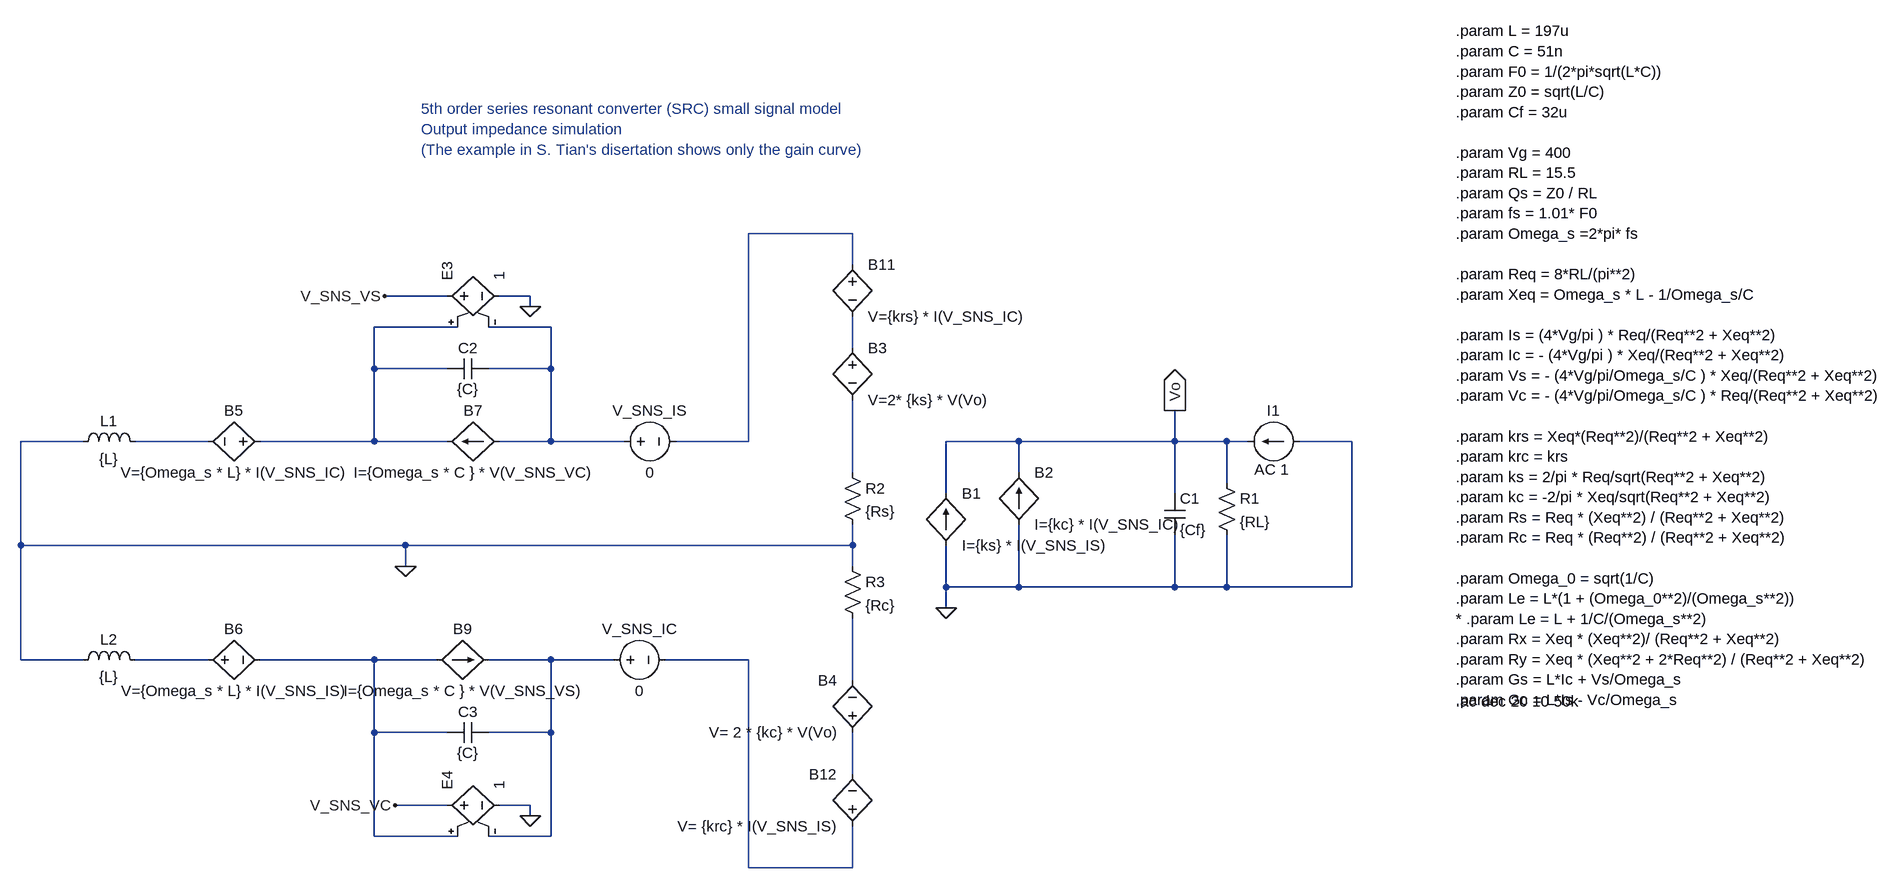
[diagram p0: schematic src_5th_eq_Zout.asc]
src_5th_eq_Zout.asc, the LTspice schematic file:
Version 4
SHEET 1 2688 680
WIRE 544 -496 384 -496
WIRE 544 -448 544 -496
WIRE -80 -400 -176 -400
WIRE 48 -400 0 -400
WIRE 48 -384 48 -400
WIRE -64 -352 -192 -352
WIRE 80 -352 -16 -352
WIRE 544 -320 544 -368
WIRE -192 -288 -192 -352
WIRE -80 -288 -192 -288
WIRE 80 -288 80 -352
WIRE 80 -288 -16 -288
WIRE -640 -176 -736 -176
WIRE -448 -176 -560 -176
WIRE -192 -176 -192 -288
WIRE -192 -176 -368 -176
WIRE -80 -176 -192 -176
WIRE 80 -176 80 -288
WIRE 80 -176 0 -176
WIRE 192 -176 80 -176
WIRE 384 -176 384 -496
WIRE 384 -176 272 -176
WIRE 800 -176 688 -176
WIRE 1040 -176 1040 -224
WIRE 1040 -176 800 -176
WIRE 1120 -176 1040 -176
WIRE 1152 -176 1120 -176
WIRE 1312 -176 1232 -176
WIRE 544 -128 544 -240
WIRE 800 -128 800 -176
WIRE 1120 -112 1120 -176
WIRE 688 -96 688 -176
WIRE 1040 -96 1040 -176
WIRE -736 -16 -736 -176
WIRE -144 -16 -736 -16
WIRE 544 -16 544 -48
WIRE 544 -16 -144 -16
WIRE -144 16 -144 -16
WIRE 544 16 544 -16
WIRE 688 48 688 -16
WIRE 800 48 800 -48
WIRE 800 48 688 48
WIRE 1040 48 1040 -32
WIRE 1040 48 800 48
WIRE 1120 48 1120 -32
WIRE 1120 48 1040 48
WIRE 1312 48 1312 -176
WIRE 1312 48 1120 48
WIRE 688 80 688 48
WIRE -736 160 -736 -16
WIRE -640 160 -736 160
WIRE -448 160 -560 160
WIRE -192 160 -368 160
WIRE -96 160 -192 160
WIRE 80 160 -16 160
WIRE 176 160 80 160
WIRE 384 160 256 160
WIRE 544 192 544 96
WIRE -192 272 -192 160
WIRE -80 272 -192 272
WIRE 80 272 80 160
WIRE 80 272 -16 272
WIRE 544 336 544 272
WIRE -80 384 -160 384
WIRE 48 384 0 384
WIRE 48 400 48 384
WIRE -192 432 -192 272
WIRE -64 432 -192 432
WIRE 80 432 80 272
WIRE 80 432 -16 432
WIRE 384 480 384 160
WIRE 544 480 544 416
WIRE 544 480 384 480
FLAG -144 16 0
FLAG 688 80 0
FLAG 1040 -224 Vo
IOPIN 1040 -224 Out
FLAG 48 -384 0
FLAG -176 -400 V_SNS_VS
FLAG 48 400 0
FLAG -160 384 V_SNS_VC
SYMBOL res 1104 -128 R0
SYMATTR InstName R1
SYMATTR Value {RL}
SYMBOL cap 1024 -96 R0
SYMATTR InstName C1
SYMATTR Value {Cf}
SYMBOL bi2 688 -96 R0
SYMATTR InstName B1
SYMATTR Value I={ks} * I(V_SNS_IS)
SYMBOL bi2 800 -128 R0
SYMATTR InstName B2
SYMATTR Value I={kc} * I(V_SNS_IC)
SYMBOL ind -656 -160 R270
WINDOW 0 32 56 VTop 2
WINDOW 3 5 56 VBottom 2
SYMATTR InstName L1
SYMATTR Value {L}
SYMBOL bv 544 -336 R0
SYMATTR InstName B3
SYMATTR Value V=2* {ks} * V(Vo)
SYMBOL ind -656 176 R270
WINDOW 0 32 56 VTop 2
WINDOW 3 5 56 VBottom 2
SYMATTR InstName L2
SYMATTR Value {L}
SYMBOL bv 544 288 R180
WINDOW 0 24 96 Left 2
WINDOW 3 24 16 Left 2
SYMATTR InstName B4
SYMATTR Value V= 2 * {kc} * V(Vo)
SYMBOL res 528 -144 R0
SYMATTR InstName R2
SYMATTR Value {Rs}
SYMBOL res 528 0 R0
SYMATTR InstName R3
SYMATTR Value {Rc}
SYMBOL voltage 176 -176 R270
WINDOW 0 32 56 VTop 2
WINDOW 3 -32 56 VBottom 2
SYMATTR InstName V_SNS_IS
SYMATTR Value 0
SYMBOL bv -352 -176 R90
WINDOW 0 -32 56 VBottom 2
WINDOW 3 32 56 VTop 2
SYMATTR InstName B5
SYMATTR Value V={Omega_s * L} * I(V_SNS_IC)
SYMBOL bv -464 160 R270
WINDOW 0 32 56 VTop 2
WINDOW 3 -32 56 VBottom 2
SYMATTR InstName B6
SYMATTR Value V={Omega_s * L} * I(V_SNS_IS)
SYMBOL cap -16 -304 R90
WINDOW 0 0 32 VBottom 2
WINDOW 3 32 32 VTop 2
SYMATTR InstName C2
SYMATTR Value {C}
SYMBOL bi2 -80 -176 R270
WINDOW 0 32 40 VTop 2
WINDOW 3 -32 40 VBottom 2
SYMATTR InstName B7
SYMATTR Value I={Omega_s * C } * V(V_SNS_VC)
SYMBOL cap -80 288 R270
WINDOW 0 32 32 VTop 2
WINDOW 3 0 32 VBottom 2
SYMATTR InstName C3
SYMATTR Value {C}
SYMBOL bi2 -16 160 R90
WINDOW 0 -32 40 VBottom 2
WINDOW 3 32 40 VTop 2
SYMATTR InstName B9
SYMATTR Value I={Omega_s * C } * V(V_SNS_VS)
SYMBOL bv 544 -464 R0
SYMATTR InstName B11
SYMATTR Value V={krs} * I(V_SNS_IC)
SYMBOL bv 544 432 R180
WINDOW 0 24 96 Left 2
WINDOW 3 24 16 Left 2
SYMATTR InstName B12
SYMATTR Value V= {krc} * I(V_SNS_IS)
SYMBOL voltage 160 160 R270
WINDOW 0 32 56 VTop 2
WINDOW 3 -32 56 VBottom 2
SYMATTR InstName V_SNS_IC
SYMATTR Value 0
SYMBOL e -96 -400 R270
SYMATTR InstName E3
SYMATTR Value 1
SYMBOL e -96 384 R270
SYMATTR InstName E4
SYMATTR Value 1
SYMBOL current 1232 -176 R90
WINDOW 0 -32 40 VBottom 2
WINDOW 3 32 40 VTop 2
WINDOW 123 59 43 VBottom 2
WINDOW 39 0 0 Left 2
SYMATTR InstName I1
SYMATTR Value ""
SYMATTR Value2 AC 1
TEXT 1472 -808 Left 2 !.param L = 197u\n.param C = 51n\n.param F0 = 1/(2*pi*sqrt(L*C))\n.param Z0 = sqrt(L/C)\n.param Cf = 32u\n \n.param Vg = 400\n.param RL = 15.5\n.param Qs = Z0 / RL\n.param fs = 1.01* F0\n.param Omega_s =2*pi* fs\n \n.param Req = 8*RL/(pi**2)\n.param Xeq = Omega_s * L - 1/Omega_s/C\n \n.param Is = (4*Vg/pi ) * Req/(Req**2 + Xeq**2)\n.param Ic = - (4*Vg/pi ) * Xeq/(Req**2 + Xeq**2)\n.param Vs = - (4*Vg/pi/Omega_s/C ) * Xeq/(Req**2 + Xeq**2)\n.param Vc = - (4*Vg/pi/Omega_s/C ) * Req/(Req**2 + Xeq**2)\n \n.param krs = Xeq*(Req**2)/(Req**2 + Xeq**2)\n.param krc = krs\n.param ks = 2/pi * Req/sqrt(Req**2 + Xeq**2)\n.param kc = -2/pi * Xeq/sqrt(Req**2 + Xeq**2)\n.param Rs = Req * (Xeq**2) / (Req**2 + Xeq**2)\n.param Rc = Req * (Req**2) / (Req**2 + Xeq**2)\n \n.param Omega_0 = sqrt(1/C)\n.param Le = L*(1 + (Omega_0**2)/(Omega_s**2))\n* .param Le = L + 1/C/(Omega_s**2)\n.param Rx = Xeq * (Xeq**2)/ (Req**2 + Xeq**2)\n.param Ry = Xeq * (Xeq**2 + 2*Req**2) / (Req**2 + Xeq**2)\n.param Gs = L*Ic + Vs/Omega_s\n.param Gc = L*Is - Vc/Omega_s
TEXT 1472 224 Left 2 !.ac dec 20 10 50k
TEXT -120 -688 Left 2 ;5th order series resonant converter (SRC) small signal model\nOutput impedance simulation\n(The example in S. Tian's disertation shows only the gain curve)

The netlist it stands for:
* src_5th_eq_Zout.asc
R1 Vo 0 {RL}
C1 Vo 0 {Cf}
B1 0 Vo I={ks} * I(V_SNS_IS)
B2 0 Vo I={kc} * I(V_SNS_IC)
L1 0 N005 {L}
B3 N004 N006 V=2* {ks} * V(Vo)
L2 0 N007 {L}
B4 N012 N011 V= 2 * {kc} * V(Vo)
R2 N006 0 {Rs}
R3 0 N011 {Rc}
V_SNS_IS N003 N001 0
B5 N002 N005 V={Omega_s * L} * I(V_SNS_IC)
B6 N007 N008 V={Omega_s * L} * I(V_SNS_IS)
C2 N003 N002 {C}
B7 N003 N002 I={Omega_s * C } * V(V_SNS_VC)
C3 N008 N009 {C}
B9 N008 N009 I={Omega_s * C } * V(V_SNS_VS)
B11 N001 N004 V={krs} * I(V_SNS_IC)
B12 N010 N012 V= {krc} * I(V_SNS_IS)
V_SNS_IC N009 N010 0
E3 V_SNS_VS 0 N002 N003 1
E4 V_SNS_VC 0 N008 N009 1
I1 0 Vo AC 1
.param L = 197u
.param C = 51n
.param F0 = 1/(2*pi*sqrt(L*C))
.param Z0 = sqrt(L/C)
.param Cf = 32u
.param Vg = 400
.param RL = 15.5
.param Qs = Z0 / RL
.param fs = 1.01* F0
.param Omega_s =2*pi* fs
.param Req = 8*RL/(pi**2)
.param Xeq = Omega_s * L - 1/Omega_s/C
.param Is = (4*Vg/pi ) * Req/(Req**2 + Xeq**2)
.param Ic = - (4*Vg/pi ) * Xeq/(Req**2 + Xeq**2)
.param Vs = - (4*Vg/pi/Omega_s/C ) * Xeq/(Req**2 + Xeq**2)
.param Vc = - (4*Vg/pi/Omega_s/C ) * Req/(Req**2 + Xeq**2)
.param krs = Xeq*(Req**2)/(Req**2 + Xeq**2)
.param krc = krs
.param ks = 2/pi * Req/sqrt(Req**2 + Xeq**2)
.param kc = -2/pi * Xeq/sqrt(Req**2 + Xeq**2)
.param Rs = Req * (Xeq**2) / (Req**2 + Xeq**2)
.param Rc = Req * (Req**2) / (Req**2 + Xeq**2)
.param Omega_0 = sqrt(1/C)
.param Le = L*(1 + (Omega_0**2)/(Omega_s**2))
* .param Le = L + 1/C/(Omega_s**2)
.param Rx = Xeq * (Xeq**2)/ (Req**2 + Xeq**2)
.param Ry = Xeq * (Xeq**2 + 2*Req**2) / (Req**2 + Xeq**2)
.param Gs = L*Ic + Vs/Omega_s
.param Gc = L*Is - Vc/Omega_s
.ac dec 20 10 50k
* 5th order series resonant converter (SRC) small signal model
* Output impedance simulation
* (The example in S. Tian's disertation shows only the gain curve)
.backanno
.end